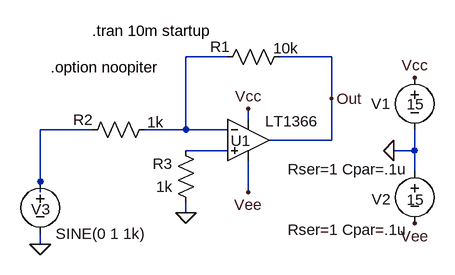
[diagram p0: schematic lt1366.asc]
lt1366.asc, the LTspice schematic file:
Version 4
SHEET 1 880 680
WIRE -176 352 -176 272
WIRE -176 368 -176 352
WIRE -176 448 -176 432
WIRE -96 272 -176 272
WIRE 48 272 -16 272
WIRE 48 272 48 160
WIRE 48 400 48 384
WIRE 112 160 48 160
WIRE 112 272 48 272
WIRE 112 304 48 304
WIRE 144 256 144 240
WIRE 144 368 144 320
WIRE 272 160 192 160
WIRE 272 224 272 160
WIRE 272 288 176 288
WIRE 272 288 272 224
WIRE 400 304 368 304
WIRE 400 304 400 272
WIRE 400 336 400 304
FLAG 368 304 0
FLAG -176 448 0
FLAG 48 400 0
FLAG 400 192 Vcc
FLAG 144 240 Vcc
FLAG 400 416 Vee
FLAG 144 368 Vee
FLAG 272 224 Out
SYMBOL Opamps\\LT1366 144 224 R0
WINDOW 0 -27 65 Left 0
WINDOW 3 26 35 Left 0
SYMATTR InstName U1
SYMBOL voltage 400 176 R0
WINDOW 123 0 0 Left 0
WINDOW 39 -195 157 Left 0
WINDOW 0 -67 56 Left 0
WINDOW 3 -12 57 Left 0
SYMATTR SpiceLine Rser=1 Cpar=.1u
SYMATTR InstName V1
SYMATTR Value 15
SYMBOL voltage 400 320 R0
WINDOW 123 0 0 Left 0
WINDOW 39 -195 106 Left 0
WINDOW 0 -66 59 Left 0
WINDOW 3 -12 60 Left 0
SYMATTR SpiceLine Rser=1 Cpar=.1u
SYMATTR InstName V2
SYMATTR Value 15
SYMBOL voltage -176 336 R0
WINDOW 123 0 0 Left 0
WINDOW 39 0 0 Left 0
WINDOW 0 -14 58 Left 0
SYMATTR InstName V3
SYMATTR Value SINE(0 1 1k)
SYMBOL res 208 144 R90
WINDOW 0 16 107 VBottom 0
WINDOW 3 -13 6 VTop 0
SYMATTR InstName R1
SYMATTR Value 10k
SYMBOL res 0 256 R90
WINDOW 0 16 110 VBottom 0
WINDOW 3 -11 -1 VTop 0
SYMATTR InstName R2
SYMATTR Value 1k
SYMBOL res 64 400 R180
WINDOW 0 36 76 Left 0
WINDOW 3 36 40 Left 0
SYMATTR InstName R3
SYMATTR Value 1k
TEXT -96 120 Left 0 !.tran 10m startup
TEXT -160 176 Left 0 !.option noopiter

The netlist it stands for:
* lt1366.asc
XU1 N003 N002 Vcc Vee Out LT1366  ; pins In+ In- V+ V- OUT
V1 Vcc 0 15 Rser=1 Cpar=.1u
V2 0 Vee 15 Rser=1 Cpar=.1u
V3 N001 0 SINE(0 1 1k)
R1 Out N002 10k
R2 N002 N001 1k
R3 0 N003 1k
.tran 10m startup
.option noopiter
.lib LTC.lib
.backanno
.end